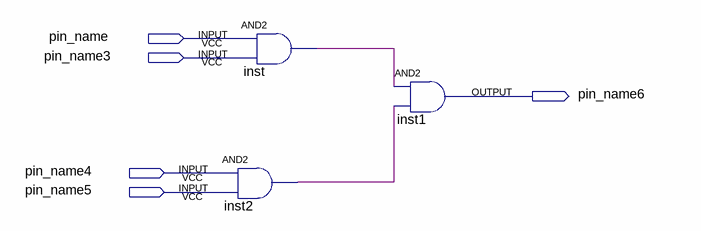
[diagram p0: schematic sheet]
// Quartus schematic BlockGate.bdf as structural Verilog: 3 symbols, 5 pins
module BlockGate (
  input  pin_name,
  input  pin_name3,
  input  pin_name4,
  input  pin_name5,
  output pin_name6
);

  wire inst2_out, inst_out;

  and inst (inst_out, pin_name, pin_name3);
  and inst2 (inst2_out, pin_name4, pin_name5);
  and inst1 (pin_name6, inst_out, inst2_out);
endmodule
